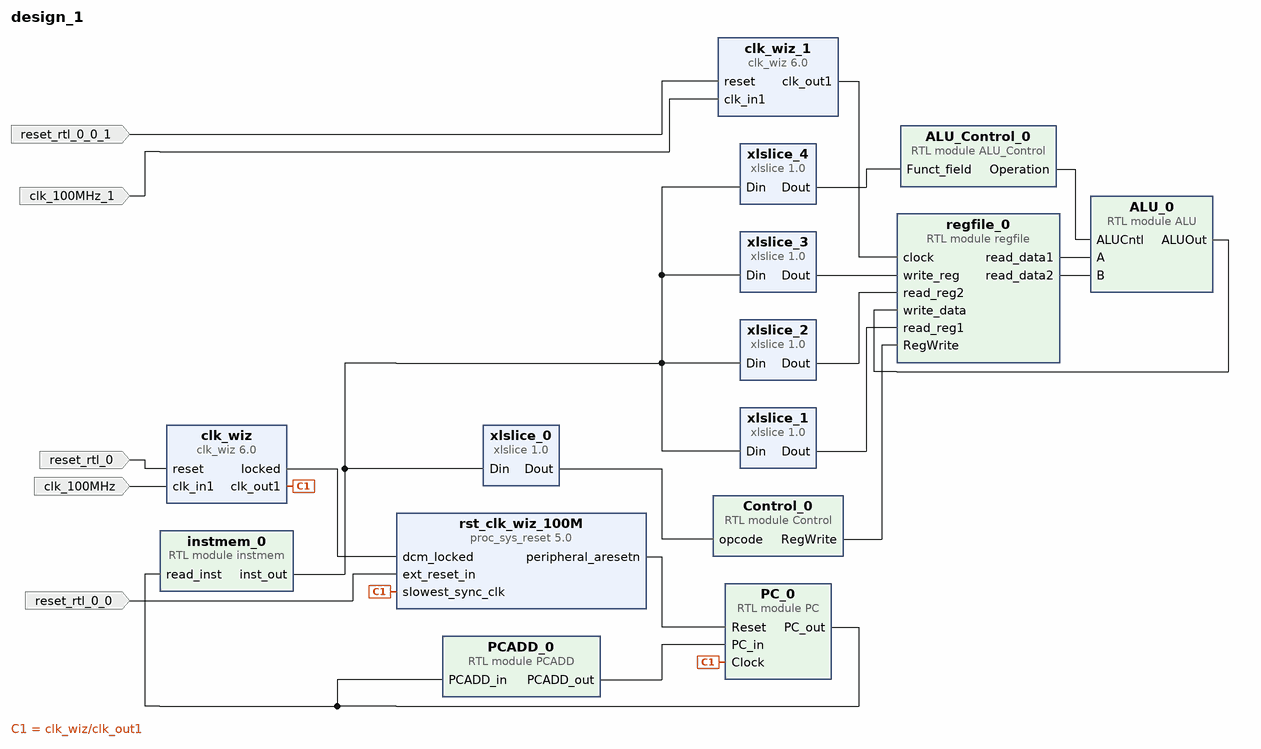
[diagram p0: block diagram of the top level]
# Vivado block design design_1, xc7k70tfbv676-1, Vivado 2019.1
create_bd_design design_1

create_bd_port -dir I -type rst reset_rtl_0
set_property -dict {CONFIG.POLARITY ACTIVE_HIGH} [get_bd_ports reset_rtl_0]
create_bd_port -dir I -type clk clk_100MHz
set_property -dict {CONFIG.FREQ_HZ 100000000} [get_bd_ports clk_100MHz]
create_bd_port -dir I -type rst reset_rtl_0_0
set_property -dict {CONFIG.POLARITY ACTIVE_LOW} [get_bd_ports reset_rtl_0_0]
create_bd_port -dir I -type rst reset_rtl_0_0_1
set_property -dict {CONFIG.POLARITY ACTIVE_HIGH} [get_bd_ports reset_rtl_0_0_1]
create_bd_port -dir I -type clk clk_100MHz_1
set_property -dict {CONFIG.FREQ_HZ 100000000} [get_bd_ports clk_100MHz_1]

create_bd_cell -type module -reference instmem instmem_0
create_bd_cell -type module -reference PCADD PCADD_0
create_bd_cell -type module -reference PC PC_0
create_bd_cell -type module -reference ALU ALU_0
create_bd_cell -type module -reference regfile regfile_0
create_bd_cell -type ip -vlnv xilinx.com:ip:clk_wiz:6.0 clk_wiz
create_bd_cell -type ip -vlnv xilinx.com:ip:proc_sys_reset:5.0 rst_clk_wiz_100M
create_bd_cell -type ip -vlnv xilinx.com:ip:clk_wiz:6.0 clk_wiz_1
create_bd_cell -type ip -vlnv xilinx.com:ip:xlslice:1.0 xlslice_0
set_property -dict {CONFIG.DIN_FROM 31 CONFIG.DIN_TO 26 CONFIG.DOUT_WIDTH 6} [get_bd_cells xlslice_0]
create_bd_cell -type ip -vlnv xilinx.com:ip:xlslice:1.0 xlslice_1
set_property -dict {CONFIG.DIN_FROM 25 CONFIG.DIN_TO 21 CONFIG.DOUT_WIDTH 5} [get_bd_cells xlslice_1]
create_bd_cell -type ip -vlnv xilinx.com:ip:xlslice:1.0 xlslice_2
set_property -dict {CONFIG.DIN_FROM 20 CONFIG.DIN_TO 16 CONFIG.DOUT_WIDTH 5} [get_bd_cells xlslice_2]
create_bd_cell -type ip -vlnv xilinx.com:ip:xlslice:1.0 xlslice_3
set_property -dict {CONFIG.DIN_FROM 15 CONFIG.DIN_TO 11 CONFIG.DOUT_WIDTH 5} [get_bd_cells xlslice_3]
create_bd_cell -type ip -vlnv xilinx.com:ip:xlslice:1.0 xlslice_4
set_property -dict {CONFIG.DIN_FROM 5 CONFIG.DIN_TO 0 CONFIG.DOUT_WIDTH 6} [get_bd_cells xlslice_4]
create_bd_cell -type module -reference Control Control_0
create_bd_cell -type module -reference ALU_Control ALU_Control_0

# ---- connections ----

connect_bd_net [get_bd_pins PC_0/PC_out] [get_bd_pins PCADD_0/PCADD_in] [get_bd_pins instmem_0/read_inst]
connect_bd_net [get_bd_pins PCADD_0/PCADD_out] [get_bd_pins PC_0/PC_in]
connect_bd_net [get_bd_pins regfile_0/read_data1] [get_bd_pins ALU_0/A]
connect_bd_net [get_bd_pins regfile_0/read_data2] [get_bd_pins ALU_0/B]
connect_bd_net [get_bd_pins clk_wiz/clk_out1] [get_bd_pins PC_0/Clock] [get_bd_pins rst_clk_wiz_100M/slowest_sync_clk]
connect_bd_net [get_bd_pins clk_wiz/locked] [get_bd_pins rst_clk_wiz_100M/dcm_locked]
connect_bd_net [get_bd_pins rst_clk_wiz_100M/peripheral_aresetn] [get_bd_pins PC_0/Reset]
connect_bd_net [get_bd_pins clk_wiz_1/clk_out1] [get_bd_pins regfile_0/clock]
connect_bd_net [get_bd_pins ALU_Control_0/Operation] [get_bd_pins ALU_0/ALUCntl]
connect_bd_net [get_bd_pins ALU_0/ALUOut] [get_bd_pins regfile_0/write_data]
connect_bd_net [get_bd_pins instmem_0/inst_out] \
  [get_bd_pins xlslice_4/Din] [get_bd_pins xlslice_3/Din] [get_bd_pins xlslice_2/Din] [get_bd_pins xlslice_1/Din] \
  [get_bd_pins xlslice_0/Din]
connect_bd_net [get_bd_pins xlslice_0/Dout] [get_bd_pins Control_0/opcode]
connect_bd_net [get_bd_pins xlslice_1/Dout] [get_bd_pins regfile_0/read_reg1]
connect_bd_net [get_bd_pins xlslice_2/Dout] [get_bd_pins regfile_0/read_reg2]
connect_bd_net [get_bd_pins xlslice_3/Dout] [get_bd_pins regfile_0/write_reg]
connect_bd_net [get_bd_pins Control_0/RegWrite] [get_bd_pins regfile_0/RegWrite]
connect_bd_net -net reset_rtl_0_1 [get_bd_ports reset_rtl_0] [get_bd_pins clk_wiz/reset]
connect_bd_net [get_bd_ports clk_100MHz] [get_bd_pins clk_wiz/clk_in1]
connect_bd_net -net reset_rtl_0_0_1 [get_bd_ports reset_rtl_0_0] [get_bd_pins rst_clk_wiz_100M/ext_reset_in]
connect_bd_net -net reset_rtl_0_0_1_1 [get_bd_ports reset_rtl_0_0_1] [get_bd_pins clk_wiz_1/reset]
connect_bd_net -net clk_100MHz_1_1 [get_bd_ports clk_100MHz_1] [get_bd_pins clk_wiz_1/clk_in1]
connect_bd_net [get_bd_pins xlslice_4/Dout] [get_bd_pins ALU_Control_0/Funct_field]

validate_bd_design
save_bd_design
